# Altium schematic sheet Sheet3.SchDoc
size A3
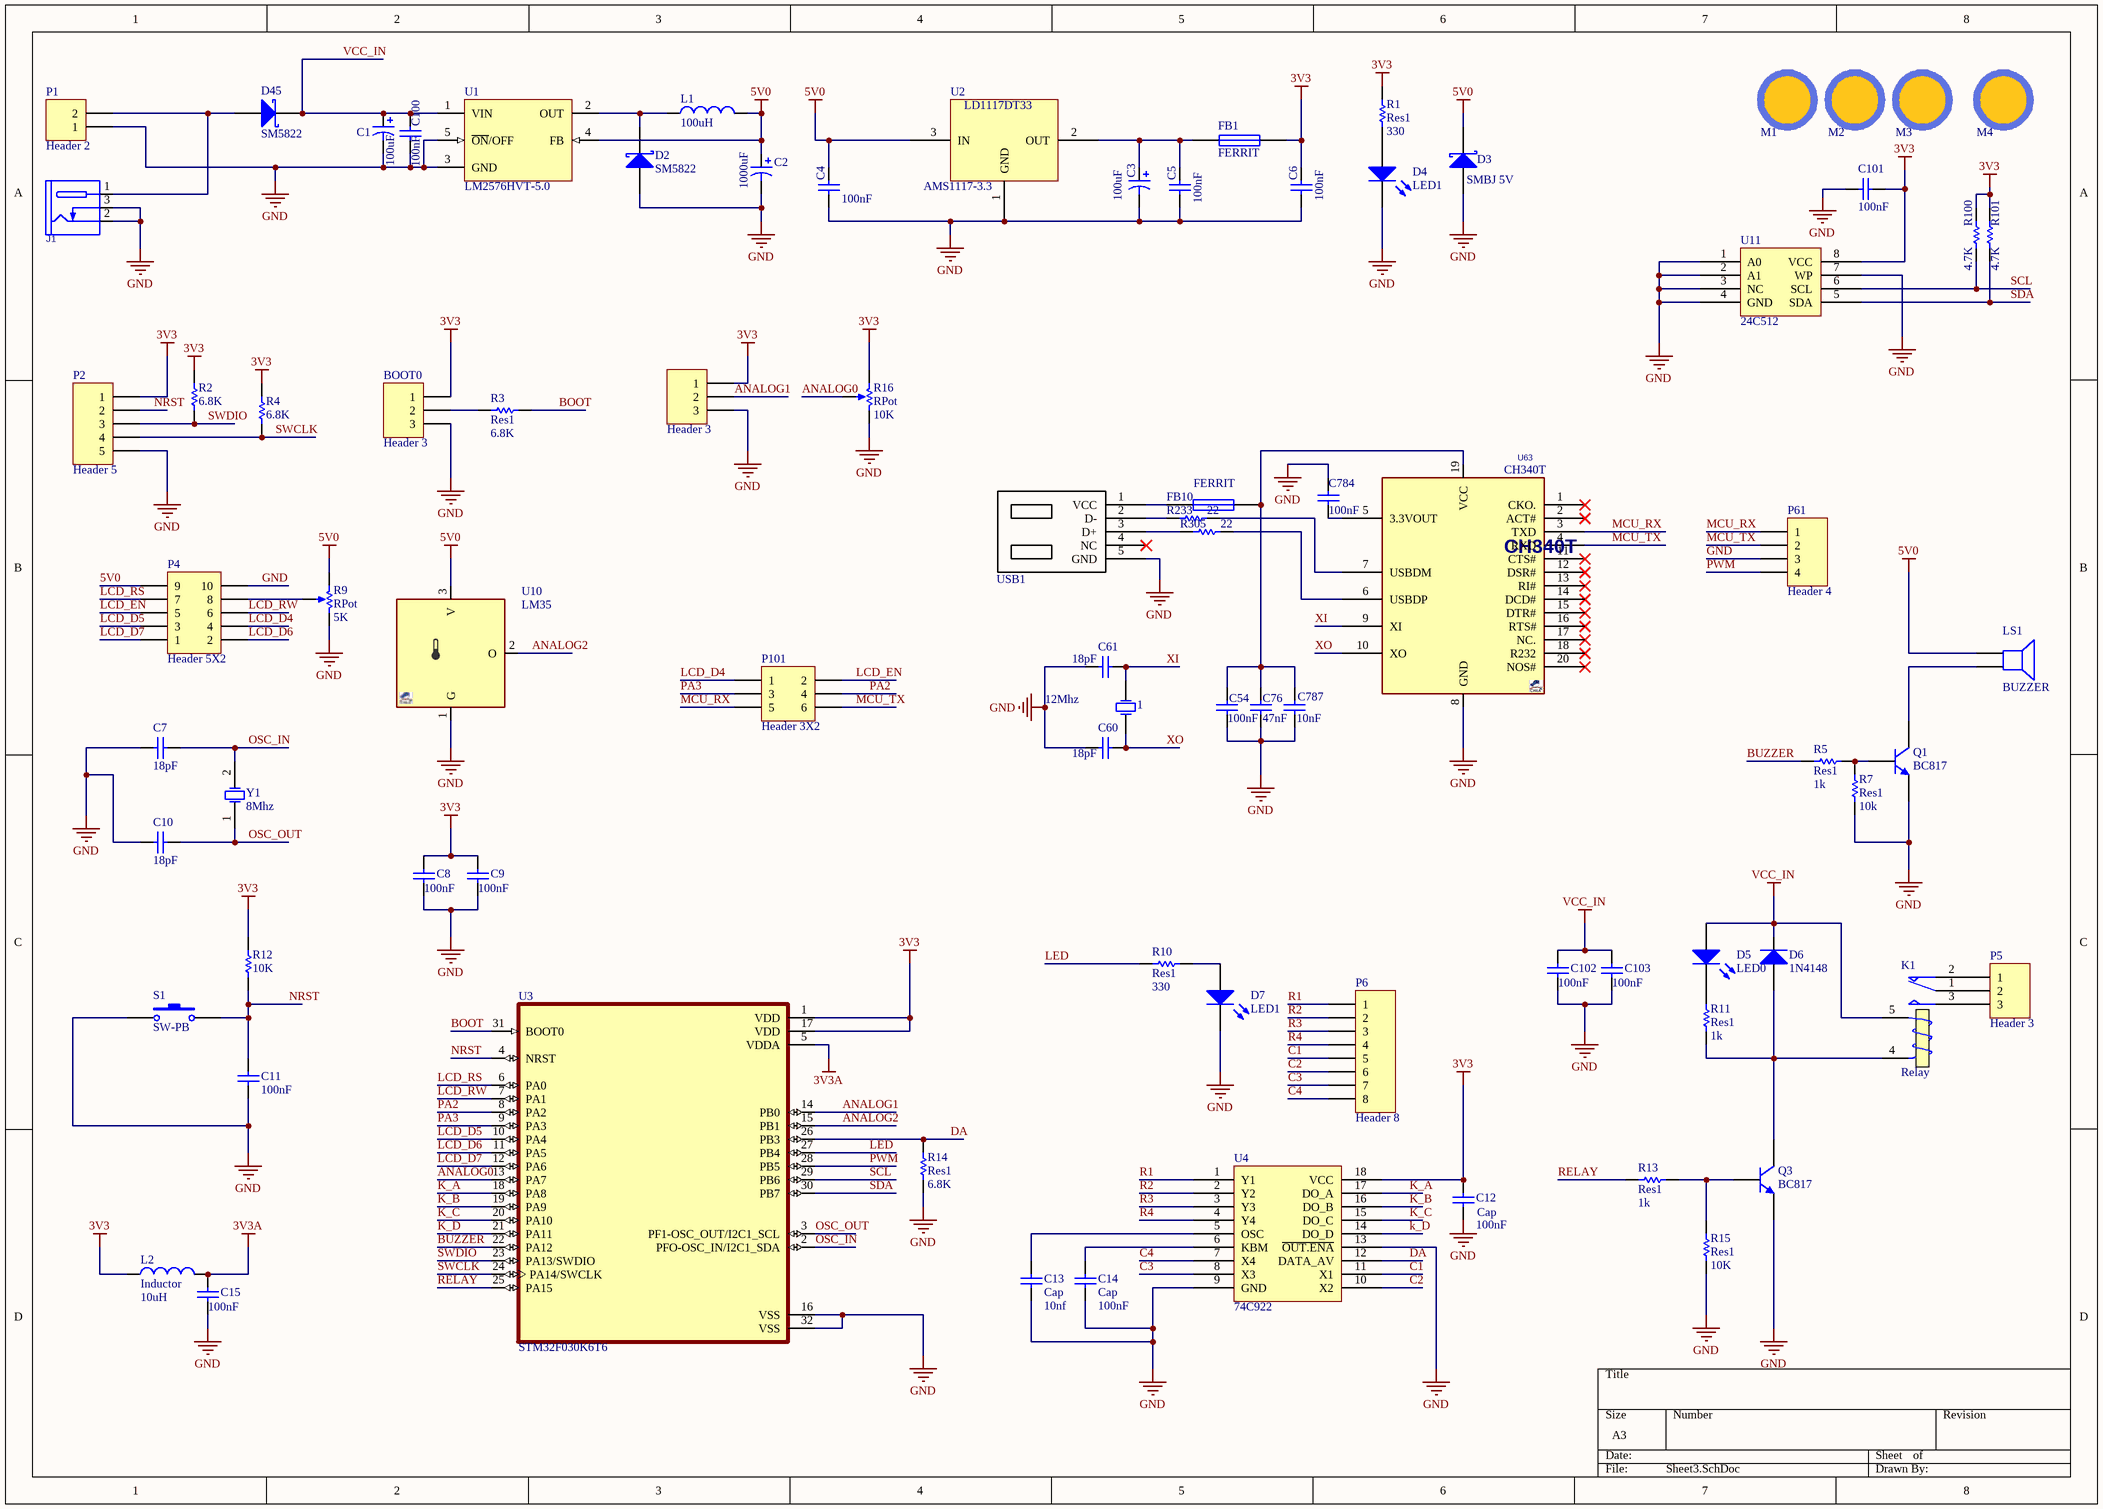
[diagram p0: Sheet3.SchDoc]

## Parts
1  12Mhz  [xtal_smd]
BOOT0  Header 3  [HDR_M_1x3]
c  Header 3  [mstbf_3]
C1  100uF  [C_EL_6_4]
C2  1000uF  [C_EL_10_10]
C3  100uF  [C_EL_6_4]
C4  100nF  [c1206s]
C5  100nF  [c1206s]
C6  100nF  [c1206s]
C7  18pF  [c1206s]
C8  value 100nF  [smd_805]  (hidden comment: Cap)
C9  value 100nF  [smd_805]  (hidden comment: Cap)
C10  18pF  [c1206s]
C11  100nF  [c1206s]
C12  Cap  value 100nF  [c1206s]
C13  Cap  value 10nf  [c1206s]
C14  Cap  value 100nF  [c1206s]
C15  value 100nF  [c1206s]  (hidden comment: Cap)
C54  100nF  [c1206s]
C60  value 18pF  [c1206s]  (hidden comment: Cap)
C61  value 18pF  [c1206s]  (hidden comment: Cap)
C76  47nF  [c1206s]
C100  100nF  [c1206s]
C101  100nF  [c1206s]
C102  value 100nF  [C1206s]  (hidden comment: Cap)
C103  value 100nF  [C1206s]  (hidden comment: Cap)
C784  100nF  [c1206s]
C787  10nF  [c1206s]
D2  SM5822  [D_SMB]
D3  SMBJ 5V  [D_SMB]
D4  LED1  [led_1206]
D5  LED0  [LED_1206]
D6  1N4148  [tvs]
D7  LED1  [led_1206]
D45  SM5822  [D_SMB]
FB1  FERRIT  [R1206s]
FB10  FERRIT  [c1206s]
J1  DC_POWER_JACK  [JAC_PWR2]  (value not drawn)
K1  Relay  [RELAY_12V]
L1  100uH  [INDUC_SMD]
L2  Inductor  value 10uH  [R1206s]
LS1  BUZZER  [bz_c12]
M1  DNP/MH  [scmh_m4]  (value not drawn)  (no BOM)
M2  DNP/MH  [scmh_m4]  (value not drawn)  (no BOM)
M3  DNP/MH  [scmh_m4]  (value not drawn)  (no BOM)
M4  DNP/MH  [scmh_m4]  (value not drawn)  (no BOM)
P1  Header 2  [mstbf_2]
P2  Header 5  [HDR_M_1x5]
P4  Header 5X2  [BOX_2X5]
P5  Header 3  [mstbf_3]
P6  Header 8  [HDR_M_1x8]
P61  Header 4  [HDR_M_1x4]
P101  Header 3X2  [HDR_M_2x3]
Q1  BC817  [SOT23]
Q3  BC817  [SOT23]
R1  Res1  value 330  [R1206s]
R2  value 6.8K  [R1206s]  (hidden comment: Res1)
R3  Res1  value 6.8K  [R1206s]
R4  value 6.8K  [R1206s]  (hidden comment: Res1)
R5  Res1  value 1k  [R1206s]
R7  Res1  value 10k  [R1206s]
R9  RPot  value 5K  [pot_3296x]
R10  Res1  value 330  [R1206s]
R11  Res1  value 1k  [R1206s]
R12  10K  [R1206s]
R13  Res1  value 1k  [R1206s]
R14  Res1  value 6.8K  [R1206s]
R15  Res1  value 10K  [R1206s]
R16  RPot  value 10K  [pot_3296x]
R100  4.7K  [R1206s]
R101  4.7K  [R1206s]
R233  value 22  [R1206]  (hidden comment: Res1)
R305  value 22  [R1206]  (hidden comment: Res1)
S1  SW-PB  [swpbs_spst_6x3x5]
U1  LM2576HVT-5.0  [D2PAK_5]
U2  AMS1117-3.3  [SOT223]
U3  STM32F030K6T6  [pcbcomponent_1]
U4  74C922  [DIP_18]
U10  LM35  [TO92_3]
U11  24C512  [so_8]
U63  CH340T  [SOG65_20_W]
USB1  MICRO_USB  [MINI_USB]  (value not drawn)
Y1  8Mhz  [xtal_smd]

## Nets
3V3: BOOT0.1 c.1 C6.2 C8.1 C9.1 C12.2 C101.1 FB1.1 L2.1 P2.1 R1.2 R2.1 R4.1 R12.2 R16.2(BOT) R100.2 R101.2 U3.1(VDD) U3.17(VDD) U4.18(VCC) U11.8(VCC)
3V3A: C15.1 L2.2 U3.5(VDDA)
5V0: C2.1 C4.2 D3.2(K) L1.2 LS1.1 P4.9 R9.2(BOT) U1.4(FB) U2.3(IN) U10.3(V)
GND: BOOT0.3 c.3 C1.2 C2.2 C3.2 C4.1 C5.1 C6.1 C7.2 C8.2 C9.2 C10.2 C11.1 C12.1 C13.1 C14.1 C15.2 C54.1 C60.1 C61.1 C76.1 C100.1 C101.2 C102.2 C103.2 C784.1 C787.1 D2.1(A) D3.1(A) D4.2(K) D7.2(K) J1.2(SLEEVE) J1.3(INSERTION_DET) P1.1 P2.5 P4.10 P61.3 Q1.2(E) Q3.2(E) R7.2 R9.1(TOP) R14.1 R15.2 R16.1(TOP) S1.1 U1.3(GND) U1.5(~{ON}/OFF) U2.1(GND) U3.16(VSS) U3.32(VSS) U4.9(GND) U4.13(~{OUT.ENA}) U10.1(G) U11.1(A0) U11.2(A1) U11.3(NC) U11.4(GND) U11.7(WP) U63.8(GND) USB1.5(GND)
VCC_IN: C1.1 C100.2 C102.1 C103.1 D5.1(A) D6.2(K) D45.2(K) K1.5(T1) U1.1(VIN)
ANALOG0: R16.3(TAP) U3.13(PA7)
ANALOG1: c.2 U3.14(PB0)
ANALOG2: U3.15(PB1) U10.2(O)
BOOT: R3.1 U3.31(BOOT0)
BUZZER: R5.2 U3.22(PA12)
C1: P6.5 U4.11(X1)
C2: P6.6 U4.10(X2)
C3: P6.7 U4.8(X3)
C4: P6.8 U4.7(X4)
DA: R14.2 U3.26(PB3) U4.12(DATA_AV)
K_A: U3.18(PA8) U4.17(DO_A)
K_B: U3.19(PA9) U4.16(DO_B)
K_C: U3.20(PA10) U4.15(DO_C)
k_D: U3.21(PA11) U4.14(DO_D)
LCD_D4: P4.4 P101.1
LCD_D5: P4.3 U3.10(PA4)
LCD_D6: P4.2 U3.11(PA5)
LCD_D7: P4.1 U3.12(PA6)
LCD_EN: P4.5 P101.2
LCD_RS: P4.7 U3.6(PA0)
LCD_RW: P4.6 U3.7(PA1)
LED: R10.2 U3.27(PB4)
MCU_RX: P61.1 P101.5 U63.3(TXD)
MCU_TX: P61.2 P101.6 U63.4(RXD)
NRST: C11.2 P2.2 R12.1 S1.2 U3.4(NRST)
OSC_IN: C7.1 U3.2(PFO-OSC_IN/I2C1_SDA) Y1.2(OSC2)
OSC_OUT: C10.1 U3.3(PF1-OSC_OUT/I2C1_SCL) Y1.1(OSC1)
PA2: P101.4 U3.8(PA2)
PA3: P101.3 U3.9(PA3)
PWM: P61.4 U3.28(PB5)
R1: P6.1 U4.1(Y1)
R2: P6.2 U4.2(Y2)
R3: P6.3 U4.3(Y3)
R4: P6.4 U4.4(Y4)
RELAY: R13.2 U3.25(PA15)
SCL: R100.1 U3.29(PB6) U11.6(SCL)
SDA: R101.1 U3.30(PB7) U11.5(SDA)
SWCLK: P2.4 R4.2 U3.24(PA14/SWCLK)
SWDIO: P2.3 R2.2 U3.23(PA13/SWDIO)
XI: 1.2(OSC2) C61.2 U63.9(XI)
XO: 1.1(OSC1) C60.2 U63.10(XO)
NetBOOT0_2: BOOT0.2 R3.2
NetC3_1: C3.1 C5.2 FB1.2 U2.2(OUT)
NetC13_2: C13.2 U4.5(OSC)
NetC14_2: C14.2 U4.6(KBM)
NetC54_2: C54.2 C76.2 C787.2 FB10.1 U63.19(VCC)
NetC784_2: C784.2 U63.5(3.3VOUT)
NetD2_2: D2.2(K) L1.1 U1.2(OUT)
NetD4_1: D4.1(A) R1.1
NetD5_2: D5.2(K) R11.1
NetD6_1: D6.1(A) K1.4(T2) Q3.3(C) R11.2
NetD7_1: D7.1(A) R10.1
NetD45_1: D45.1(A) J1.1(TIP) P1.2
NetFB10_2: FB10.2 USB1.1(VCC)
NetK1_1: K1.1(COM) P5.2
NetK1_2: K1.2(NC) P5.1
NetK1_3: K1.3(NO) P5.3
NetLS1_2: LS1.2 Q1.3(C)
NetP4_8: P4.8 R9.3(TAP)
NetQ1_1: Q1.1(B) R5.1 R7.1
NetQ3_1: Q3.1(B) R13.1 R15.1
NetR233_1: R233.1 U63.7(USBDM)
NetR233_2: R233.2 USB1.2(D-)
NetR305_1: R305.1 U63.6(USBDP)
NetR305_2: R305.2 USB1.3(D+)

Not connected (* = marked no-connect by the designer): U63 1(CKO.)* 2(ACT#)* 11(CTS#)* 12(DSR#)* 13(RI#)* 14(DCD#)* 15(DTR#)* 16(RTS#)* 17(NC.)* 18(R232)* 20(NOS#)*; USB1 4(NC)*

## Library data of the parts
1 Y1 = XTAL: Crystal Oscillator; Published: 8-Jun-2000; LatestRevisionDate: 17-Jul-2002; LatestRevisionNote: Re-released for DXP Platform.; PackageReference: R38; Publisher: Altium Limited
BOOT0 c P5 = Header 3: Header, 3-Pin; LatestRevisionDate: 17-Jul-2002; LatestRevisionNote: Re-released for DXP Platform.; Publisher: Altium Limited
C1-C3 = Cap Pol1: Polarized Capacitor (Radial); Published: 8-Jun-2000; LatestRevisionDate: 17-Jul-2002; LatestRevisionNote: Re-released for DXP Platform.; PackageReference: RB7.6-15; Publisher: Altium Limited
  C1 C3: Value: 100uF
  C2: Value: 1000uF
C4-C15 C54 C60 C61 C76 C100-C103 C784 C787 = Cap: Capacitor; Published: 8-Jun-2000; LatestRevisionDate: 17-Jul-2002; LatestRevisionNote: Re-released for DXP Platform.; PackageReference: RAD-0.3; Publisher: Altium Limited
  C4-C6 C11 C54 C100 C101 C784: Value: 100nF
  C7 C10: Value: 18pF
  C76: Value: 47nF
  C787: Value: 10nF
D2 D3 D45 = Diode 11DQ03: Schottky Rectifier; Published: 8-Jun-2000; LatestRevisionDate: 17-Jul-2002; LatestRevisionNote: Re-released for DXP Platform.; DatasheetVersion: Dec-1997; PackageReference: DO-204AL; Publisher: Altium Limited; Code_JEDEC: DO-204-AL; ComponentLink1Description: Manufacturer Link; ComponentLink1URL: http://www.irf.com/; ComponentLink2Description: Datasheet; ComponentLink2URL: http://www.irf.com/product-info/datasheets/data/11dq03.pdf
D4 D7 = LED1: Typical RED GaAs LED; Published: 8-Jun-2000; LatestRevisionDate: 08-Jul-2005; LatestRevisionNote: Mech Layer 1 removed.; PackageReference: LED-1; Publisher: Altium Limited
D5 = LED0: Typical INFRARED GaAs LED; Published: 8-Jun-2000; LatestRevisionDate: 08-Jul-2005; LatestRevisionNote: Mech Layer 1 removed.; PackageReference: LED-0; Publisher: Altium Limited
D6 = Diode: Default Diode; Published: 8-Jun-2000; LatestRevisionDate: 17-Jul-2002; LatestRevisionNote: Re-released for DXP Platform.; PackageVersion: Sep-1996; PackageReference: SMC; Publisher: Altium Limited; Code_JEDEC: DO-214-AB
FB1 FB10 = Fuse 1: Fuse; Published: 8-Jun-2000; LatestRevisionDate: 17-Jul-2002; LatestRevisionNote: Re-released for DXP Platform.; PackageReference: PIN-W2/E2.8; Publisher: Altium Limited
J1 = CONN_PWR_JACKR2: CONN, PWR JACK DC, PLUG DIAM 2.0MM RA THD; MANF: CUI STACK; MANF_P#: PJ-202A, PJ-002AH, PJ-102AH, KLDX-0202; VALUE: DC_POWER_JACK
K1 = Relay: SPDT Relay; Published: 8-Jun-2000; LatestRevisionDate: 17-Jul-2002; LatestRevisionNote: Re-released for DXP Platform.; PackageReference: MODULE5B; Publisher: Altium Limited
L1 L2 = Inductor: Code_IEC: 1005; Published: 8-Jun-2000; LatestRevisionDate: 29-May-2009; LatestRevisionNote: IPC-7351 Footprint Added.; PackageReference: 0402-A; Publisher: Altium Limited; PackageDescription: Chip Inductor; Code_JEITA: 0402
  L1: Value: 100uH
LS1 = Speaker: Loudspeaker; Published: 24-Mar-1999; LatestRevisionDate: 17-Jul-2002; LatestRevisionNote: Re-released for DXP Platform.; PackageReference: PIN2; Publisher: Altium Limited
M1-M4 = PSPMH3: Plastic Spacer mouting, Hole 3mm; ASSEMBLY: DNP; VALUE: DNP/MH
P1 = Header 2: Header, 2-Pin; LatestRevisionDate: 17-Jul-2002; LatestRevisionNote: Re-released for DXP Platform.; Publisher: Altium Limited
P2 = Header 5: Header, 5-Pin; LatestRevisionDate: 17-Jul-2002; LatestRevisionNote: Re-released for DXP Platform.; Publisher: Altium Limited
P4 = Header 5X2: Header, 5-Pin, Dual row; LatestRevisionDate: 17-Jul-2002; LatestRevisionNote: Re-released for DXP Platform.; Publisher: Altium Limited
P6 = Header 8: Header, 8-Pin; LatestRevisionDate: 17-Jul-2002; LatestRevisionNote: Re-released for DXP Platform.; Publisher: Altium Limited
P61 = Header 4: Header, 4-Pin; LatestRevisionDate: 17-Jul-2002; LatestRevisionNote: Re-released for DXP Platform.; Publisher: Altium Limited
P101 = Header 3X2: Header, 3-Pin, Dual row; LatestRevisionDate: 17-Jul-2002; LatestRevisionNote: Re-released for DXP Platform.; Publisher: Altium Limited
Q1 Q3 = 2N3904: NPN General Purpose Amplifier; Published: 8-Jun-2000; LatestRevisionDate: 15-Jan-2003; LatestRevisionNote: PCB Footprint 'BCY-W3/D4.7' replaced; DatasheetVersion: 1997; PackageVersion: Sep-1998; PackageReference: TO-92A; Publisher: Altium Limited; Code_JEDEC: TO-92A; ComponentLink1Description: Manufacturer Link; ComponentLink1URL: http://www.fairchildsemi.com/; ComponentLink2Description: Datasheet; ComponentLink2URL: http://www.fairchildsemi.com/ds/2N%2F2N3904.pdf
R1-R5 R7 R10-R15 R100 R101 R233 R305 = Res1: Resistor; Published: 8-Jun-2000; LatestRevisionDate: 17-Jul-2002; LatestRevisionNote: Re-released for DXP Platform.; PackageReference: AXIAL-0.3; Publisher: Altium Limited
  R12: Value: 10K
  R100 R101: Value: 4.7K
R9 R16 = RPot: Potentiometer; Sim Note: Enter the Resistance value and the set point into parameter fields.; Set Position: 0.5; Published: 8-Jun-2000; LatestRevisionDate: 17-Jul-2002; LatestRevisionNote: Re-released for DXP Platform.; PackageReference: VR5; Publisher: Altium Limited
S1 = SW-PB: Switch; Published: 24-Mar-1999; LatestRevisionDate: 17-Jul-2002; LatestRevisionNote: Re-released for DXP Platform.; PackageReference: SPST-2; Publisher: Altium Limited
U1 = LM2576HVT-5.0: SIMPLE SWITCHER; 3A Step-Down Voltage Regulator; Manufacturer: National Semiconductor; PackageTopMarking: NSUZXYTT*LM2576HVT*-5.0 P+; PowerWise: N; Published: 4-Dec-2008; DatasheetVersion: Aug-2004; PackageVersion: revJ, Jan-1992; PackageReference: T05A; Publisher: Altium Limited; PackageDescription: TO-220, Molded, 5 Lead, Straight; CompType: Switcher; PartNumber: LM2576HVT-5.0; RoHS: O; PinCount: 5; DigiKeyPartNumber: LM2576HVT-5.0-ND; Code_JEDEC: TO-220-AB; ComponentLink1Description: LM2576HV Datasheet; ComponentLink1URL: http://www.national.com/ds/LM/LM2576HV.pdf; ComponentLink2Description: LM2576HV Web Page; ComponentLink2URL: http://www.national.com/pf/LM/LM2576HV.html; ComponentLink3Description: T05A Package Page; ComponentLink3URL: http://www.national.com/packaging/folders/t05a.html
U2 = LD1117DT33
U3 = STM32F030K6T6: ARMÂ® CortexÂ®-M0 STM32F0 Microcontroller IC 32-Bit 48MHz 32KB _32K x 8_ FLASH 32-LQFP _7x7_; MF: STMicroelectronics; Price: None; SnapEDA_Link: https://www.snapeda.com/parts/STM32F030K6T6/STMicroelectronics/view-part/131742/?ref=snap; Availability: Unavailable; MP: STM32F030K6T6; Package: LQFP-32 STMicroelectronics; Value: *
U4 = Component_1
U10 = TMP_LM35_TO92: SENSOR, TEMP, ANALOG, -55~150oC, 4~20Vcc, Out 0mV + 10mV/oC; MANF_P#: LM35CZ, LM35CAZ or LM35DZ; MANF: TI; PARAM: 0.5°C Accuracy, 10mV/oC, -55~150oC; PARAM2: 4~20Vcc; PRICE: 7$; VALUE: LM35
U11 = 24Cxx
U63 = CH340T_SSOP20: USB-UART; MANF: CHINA; MANF_P#: CH340T; VALUE: CH340T